# EAGLE design xnemo (EAGLE 6.2)
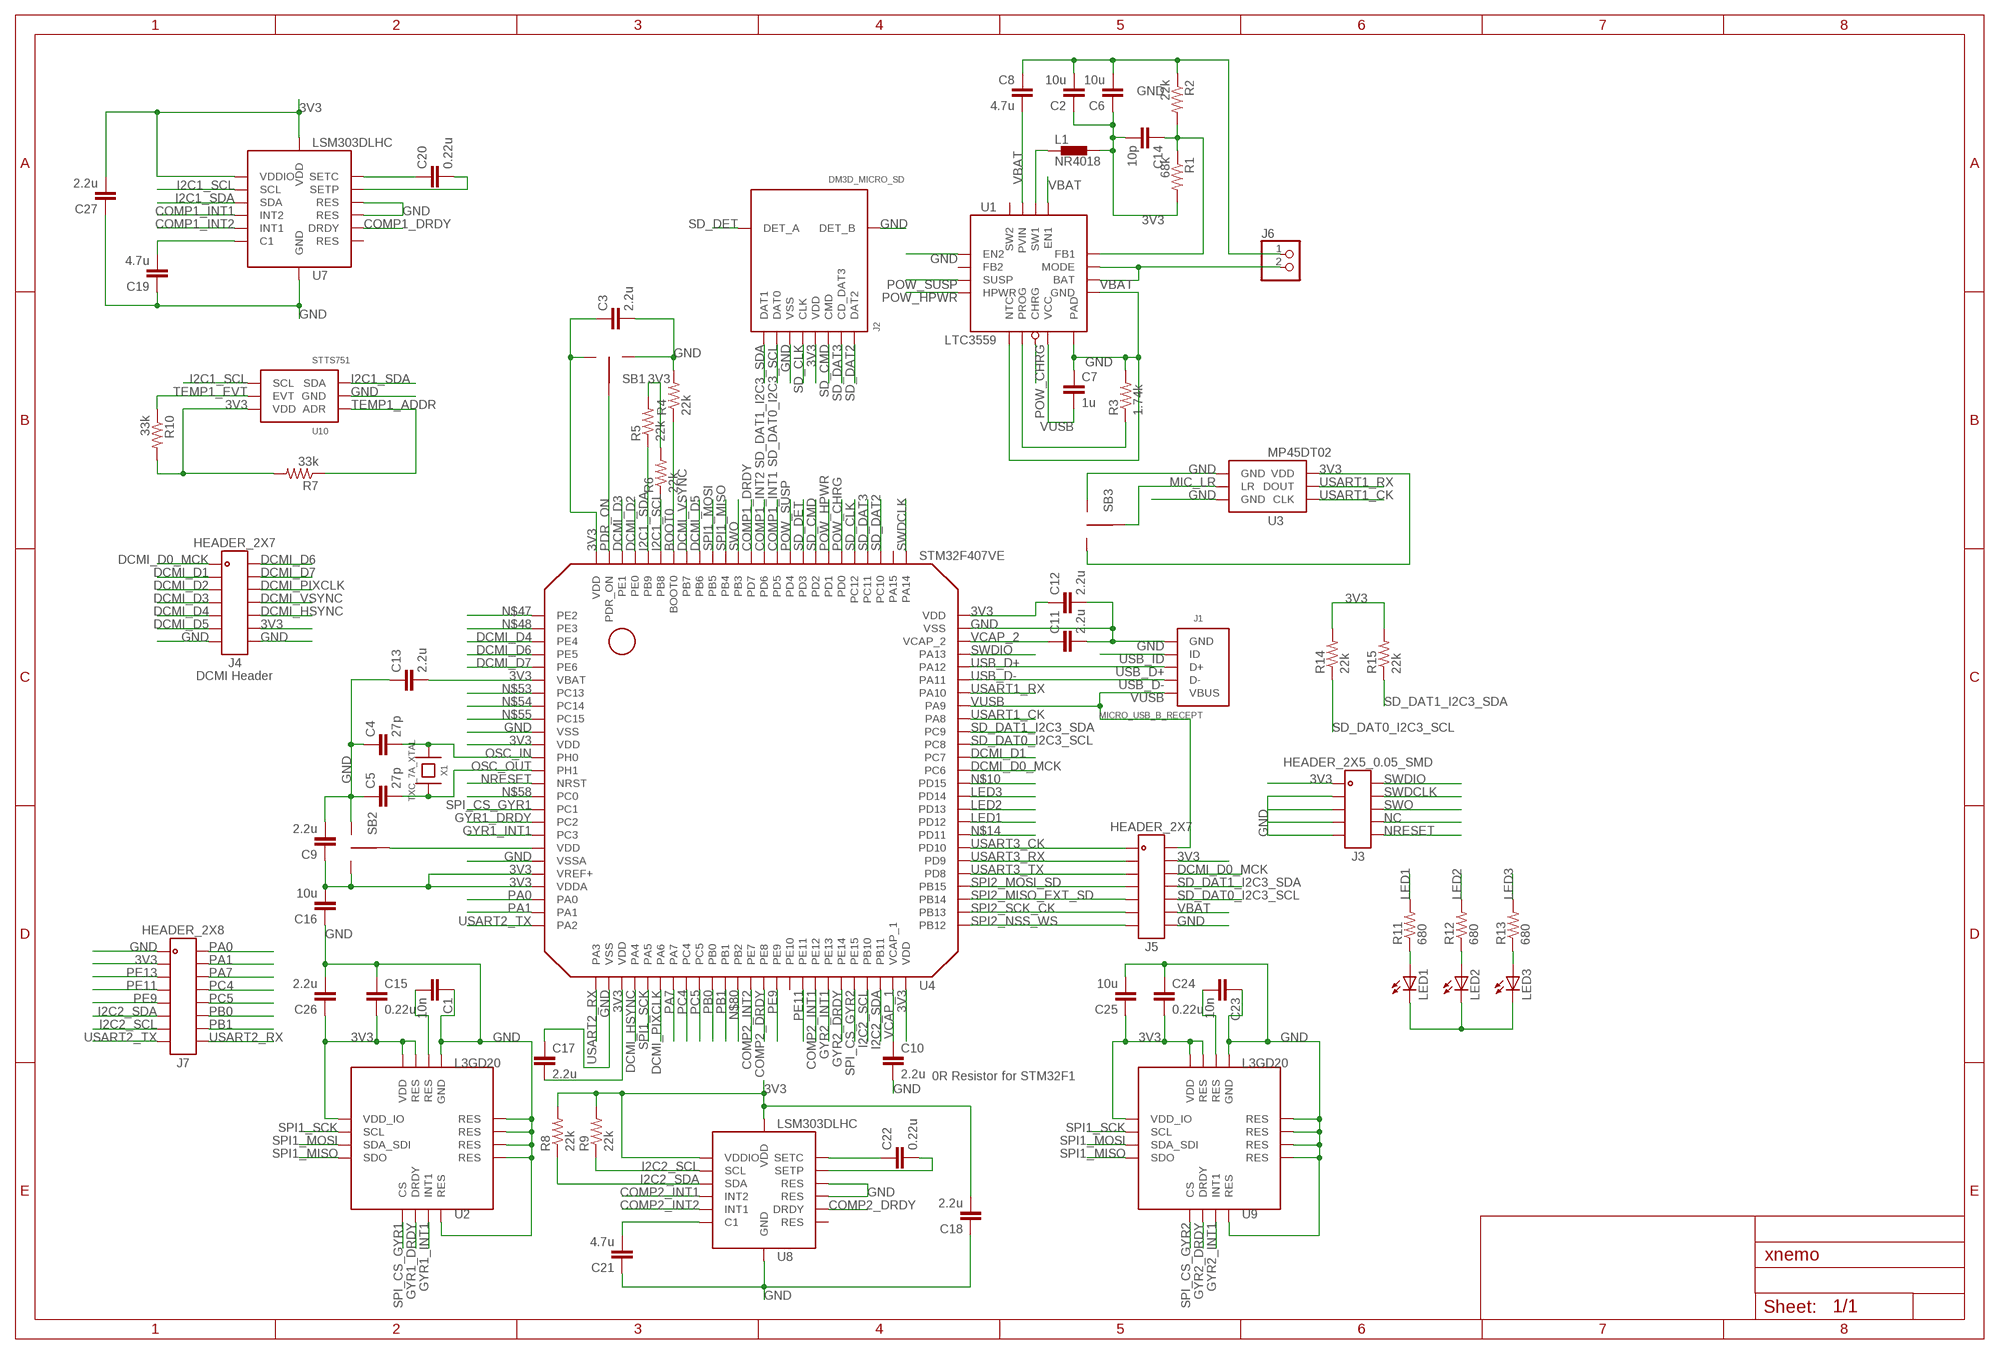
[diagram p0: schematic, sheet 1]

## Parts
C1  10n  C-EUC0402  [C0402]
C2  10u  C-EUC0805  [C0805]
C3  2.2u  C-EUC0603  [C0603]
C4  27p  C-EUC0402  [C0402]
C5  27p  C-EUC0402  [C0402]
C6  10u  C-EUC0805  [C0805]
C7  1u  C-EUC0603  [C0603]
C8  4.7u  C-EUC0805  [C0805]
C9  2.2u  C-EUC0603  [C0603]
C10  2.2u  C-EUC0603  [C0603]
C11  2.2u  C-EUC0603  [C0603]
C12  2.2u  C-EUC0603  [C0603]
C13  2.2u  C-EUC0603  [C0603]
C14  10p  C-EUC0402  [C0402]
C15  0.22u  C-EUC0402  [C0402]
C16  10u  C-EUC0805  [C0805]
C17  2.2u  C-EUC0603  [C0603]
C18  2.2u  C-EUC0603  [C0603]
C19  4.7u  C-EUC0805  [C0805]
C20  0.22u  C-EUC0402  [C0402]
C21  4.7u  C-EUC0805  [C0805]
C22  0.22u  C-EUC0402  [C0402]
C23  10n  C-EUC0402  [C0402]
C24  0.22u  C-EUC0402  [C0402]
C25  10u  C-EUC0805  [C0805]
C26  2.2u  C-EUC0603  [C0603]
C27  2.2u  C-EUC0603  [C0603]
J1  MICRO_USB_B_RECEPT  [FCI_MICRO_USB_B]
J2  DM3D_MICRO_SD  [HIROSE_DM3D]
J3  HEADER_2X5_0.05_SMD  [HEADER_2X5_0.05_SMD]
J4  HEADER_2X7  [HEADER_2X7_0.05X0.1_THRU]
J5  HEADER_2X7  [HEADER_2X7_0.05X0.1_THRU]
J6  PINHD-1X2  [1X02]
J7  HEADER_2X8  [HEADER_2X8_0.05X0.1_THRU]
L1  NR4018  [L_401X]
LED1  LEDSML0805  [SML0805]
LED2  LEDSML0805  [SML0805]
LED3  LEDSML0805  [SML0805]
R1  68k  R-US_R0402  [R0402]
R2  22k  R-US_R0402  [R0402]
R3  1.74k  R-US_R0402  [R0402]
R4  22k  R-US_R0402  [R0402]
R5  22k  R-US_R0402  [R0402]
R6  22k  R-US_R0402  [R0402]
R7  33k  R-US_R0402  [R0402]
R8  22k  R-US_R0402  [R0402]
R9  22k  R-US_R0402  [R0402]
R10  33k  R-US_R0402  [R0402]
R11  680  R-US_R0402  [R0402]
R12  680  R-US_R0402  [R0402]
R13  680  R-US_R0402  [R0402]
R14  22k  R-US_R0402  [R0402]
R15  22k  R-US_R0402  [R0402]
SB1  SOLDER_BRIDGE_2  [SOLDER_BRIDGE_2]
SB2  SOLDER_BRIDGE_2  [SOLDER_BRIDGE_2]
SB3  SOLDER_BRIDGE_2  [SOLDER_BRIDGE_2]
U1  LTC3559  [LT_QFN16_3X3]
U2  L3GD20  [ST_LGA16_4X4]
U3  MP45DT02  [ST_HLGA6]
U4  STM32F407VE  [ST_LQFP100]
U7  LSM303DLHC  [ST_LGA14_3X5]
U8  LSM303DLHC  [ST_LGA14_3X5]
U9  L3GD20  [ST_LGA16_4X4]
U10  STTS751  [ST_UDFN-6L_2X2]
X1  TXC_7A_XTAL  [TXC_7A_XTAL]

## Nets
3V3 [power]: C2.1 C3.1 C6.1 C9.1 C12.1 C13.2 C14.2 C15.2 C16.2 C17.2 C18.2 C24.2 C25.1 C26.1 C27.2 J2.P$5(VDD) J3.1 J4.12 J5.4 J7.3 L1.P$2 R1.2 R5.2 R6.2 R7.2 R8.2 R9.2 R10.2 R14.2 R15.2 SB1.P$1 SB2.P$1 SB3.P$1 U2.P$1(VDD_IO) U2.P$15(RES) U2.P$16(VDD) U3.6(VDD) U4.P$6(VBAT) U4.P$11(VDD) U4.P$21(VREF+) U4.P$22(VDDA) U4.P$28(VDD) U4.P$50(VDD) U4.P$75(VDD) U4.P$100(VDD) U7.P$1(VDDIO) U7.P$14(VDD) U8.P$1(VDDIO) U8.P$14(VDD) U9.P$1(VDD_IO) U9.P$15(RES) U9.P$16(VDD) U10.3(VDD)
BOOT0: R4.1 U4.P$94(BOOT0)
BUCK_FB1: C14.1 R1.1 R2.2 U1.P$4(FB1)
BUCK_SW1: L1.P$1 U1.P$6(SW1)
COMP1_C1: C19.2 U7.P$6(C1)
COMP1_DRDY: U4.P$88(PD7) U7.P$9(DRDY)
COMP1_INT1: U4.P$86(PD5) U7.P$4(INT2)
COMP1_INT2: U4.P$87(PD6) U7.P$5(INT1)
COMP2_C1: C21.2 U8.P$6(C1)
COMP2_DRDY: U4.P$39(PE8) U8.P$9(DRDY)
COMP2_INT1: U4.P$43(PE12) U8.P$4(INT2)
COMP2_INT2: U4.P$38(PE7) U8.P$5(INT1)
DCMI_D0_MCK: J4.1 J5.6 U4.P$63(PC6)
DCMI_D1: J4.3 U4.P$64(PC7)
DCMI_D2: J4.5 U4.P$97(PE0)
DCMI_D3: J4.7 U4.P$98(PE1)
DCMI_D4: J4.9 U4.P$3(PE4)
DCMI_D5: J4.11 U4.P$92(PB6)
DCMI_D6: J4.2 U4.P$4(PE5)
DCMI_D7: J4.4 U4.P$5(PE6)
DCMI_HSYNC: J4.10 U4.P$29(PA4)
DCMI_PIXCLK: J4.6 U4.P$31(PA6)
DCMI_VSYNC: J4.8 U4.P$93(PB7)
GND: C1.1 C2.2 C3.2 C4.1 C5.1 C6.2 C7.1 C8.1 C9.2 C10.2 C11.2 C12.2 C13.1 C15.1 C16.1 C17.1 C18.1 C19.1 C21.1 C23.1 C24.1 C25.2 C26.2 C27.1 J1.P$5(GND) J2.P$3(VSS) J2.P$9(DET_B) J3.3 J3.5 J3.7 J3.9 J4.13 J4.14 J5.14 J6.1 J7.1 LED1.C LED2.C LED3.C R2.1 R3.2 R4.2 SB1.P$3 SB2.P$3 SB3.P$3 U1.P$1(GND) U1.P$9(EN2) U1.P$13(NTC) U1.P$17(PAD) U2.P$8(RES) U2.P$9(RES) U2.P$10(RES) U2.P$11(RES) U2.P$12(RES) U2.P$13(GND) U3.1(GND) U3.3(GND) U4.P$10(VSS) U4.P$20(VSSA) U4.P$27(VSS) U4.P$74(VSS) U7.P$7(GND) U7.P$10(RES) U7.P$11(RES) U8.P$7(GND) U8.P$10(RES) U8.P$11(RES) U9.P$8(RES) U9.P$9(RES) U9.P$10(RES) U9.P$11(RES) U9.P$12(RES) U9.P$13(GND) U10.5(GND)
GYR1_DRDY: U2.P$6(DRDY) U4.P$17(PC2)
GYR1_INT1: U2.P$7(INT1) U4.P$18(PC3)
GYR2_DRDY: U4.P$45(PE14) U9.P$6(DRDY)
GYR2_INT1: U4.P$44(PE13) U9.P$7(INT1)
GYR_RES1: C1.2 U2.P$14(RES)
GYR_RES2: C23.2 U9.P$14(RES)
I2C1_SCL: R6.1 U4.P$95(PB8) U7.P$2(SCL) U10.1(SCL)
I2C1_SDA: R5.1 U4.P$96(PB9) U7.P$3(SDA) U10.6(SDA)
I2C2_SCL: J7.13 R9.1 U4.P$47(PB10) U8.P$2(SCL)
I2C2_SDA: J7.11 R8.1 U4.P$48(PB11) U8.P$3(SDA)
LED1: R11.2 U4.P$59(PD12)
LED2: R12.2 U4.P$60(PD13)
LED3: R13.2 U4.P$61(PD14)
MIC_LR: SB3.P$2 U3.2(LR)
N$6: C22.2 U8.P$12(SETP)
N$7: C20.2 U7.P$12(SETP)
N$9: LED1.A R11.1
N$10: U4.P$62(PD15)
N$14: U4.P$58(PD11)
N$16: LED2.A R12.1
N$17: LED3.A R13.1
N$23: C22.1 U8.P$13(SETC)
N$27: C20.1 U7.P$13(SETC)
N$47: U4.P$1(PE2)
N$48: U4.P$2(PE3)
N$53: U4.P$7(PC13)
N$54: U4.P$8(PC14)
N$55: U4.P$9(PC15)
N$58: U4.P$15(PC0)
N$62: SB2.P$2 U4.P$19(VDD)
N$80: U4.P$37(PB2)
NC: J3.8
NRESET: J3.10 U4.P$14(NRST)
OSC_IN: C4.2 U4.P$12(PH0) X1.P$2
OSC_OUT: C5.2 U4.P$13(PH1) X1.P$1
PA0: J7.2 U4.P$23(PA0)
PA1: J7.4 U4.P$24(PA1)
PA7: J7.6 U4.P$32(PA7)
PB0: J7.12 U4.P$35(PB0)
PB1: J7.14 U4.P$36(PB1)
PC4: J7.8 U4.P$33(PC4)
PC5: J7.10 U4.P$34(PC5)
PDR_ON: SB1.P$2 U4.P$99(PDR_ON)
PE9: J7.9 U4.P$40(PE9)
PE11: J7.7 U4.P$42(PE11)
PE13: J7.5
POW_CHRG: U1.P$15(CHRG) U4.P$81(PD0)
POW_HPWR: U1.P$12(HPWR) U4.P$82(PD1)
POW_PROG: R3.1 U1.P$14(PROG)
POW_SUSP: U1.P$11(SUSP) U4.P$85(PD4)
SD_CLK: J2.P$4(CLK) U4.P$80(PC12)
SD_CMD: J2.P$6(CMD) U4.P$83(PD2)
SD_DAT0_I2C3_SCL: J2.P$2(DAT0) J5.10 R14.1 U4.P$65(PC8)
SD_DAT1_I2C3_SDA: J2.P$1(DAT1) J5.8 R15.1 U4.P$66(PC9)
SD_DAT2: J2.P$8(DAT2) U4.P$78(PC10)
SD_DAT3: J2.P$7(CD_DAT3) U4.P$79(PC11)
SD_DET: J2.P$10(DET_A) U4.P$84(PD3)
SPI1_MISO: U2.P$4(SDO) U4.P$90(PB4) U9.P$4(SDO)
SPI1_MOSI: U2.P$3(SDA_SDI) U4.P$91(PB5) U9.P$3(SDA_SDI)
SPI1_SCK: U2.P$2(SCL) U4.P$30(PA5) U9.P$2(SCL)
SPI2_MISO_EXT_SD: J5.9 U4.P$53(PB14)
SPI2_MOSI_SD: J5.7 U4.P$54(PB15)
SPI2_NSS_WS: J5.13 U4.P$51(PB12)
SPI2_SCK_CK: J5.11 U4.P$52(PB13)
SPI_CS_GYR1: U2.P$5(CS) U4.P$16(PC1)
SPI_CS_GYR2: U4.P$46(PE15) U9.P$5(CS)
SWDCLK: J3.4 U4.P$76(PA14)
SWDIO: J3.2 U4.P$72(PA13)
SWO: J3.6 U4.P$89(PB3)
TEMP1_ADDR: R7.1 U10.4(ADR)
TEMP1_EVT: R10.1 U10.2(EVT)
USART1_CK: U3.4(CLK) U4.P$67(PA8)
USART1_RX: U3.5(DOUT) U4.P$69(PA10)
USART2_RX: J7.16 U4.P$26(PA3)
USART2_TX: J7.15 U4.P$25(PA2)
USART3_CK: J5.1 U4.P$57(PD10)
USART3_RX: J5.3 U4.P$56(PD9)
USART3_TX: J5.5 U4.P$55(PD8)
USB_D+: J1.P$3(D+) U4.P$71(PA12)
USB_D-: J1.P$2(D-) U4.P$70(PA11)
USB_ID: J1.P$4(ID)
VBAT: C8.2 J5.12 J6.2 U1.P$2(BAT) U1.P$3(MODE) U1.P$5(EN1) U1.P$7(PVIN)
VCAP_1: C10.1 U4.P$49(VCAP_1)
VCAP_2: C11.1 U4.P$73(VCAP_2)
VUSB: C7.2 J1.P$1(VBUS) J5.2 U1.P$16(VCC) U4.P$68(PA9)
Unconnected: U1.P$8(SW2) U1.P$10(FB2) U4.P$41(PE10) U4.P$77(PA15) U7.P$8(RES) U8.P$8(RES)

## Notes on the sheet
- DCMI Header
- 0R Resistor for STM32F1

## Library data of the parts
C1-C27 = resistor:C-EU: CAPACITOR, European symbol
J1 = xnemo:MICRO_USB_B_RECEPT
J2 = xnemo:DM3D_MICRO_SD
J3 = xnemo:HEADER_2X5
J4 J5 = xnemo:HEADER_2X7
J6 = pinhead:PINHD-1X2: PIN HEADER
J7 = xnemo:HEADER_2X8
L1 = xnemo:NR4018: Taiyo Yuden NR401x SMT power inductor
LED1-LED3 = led:LED: LED OSRAM: - CHIPLED LG R971, LG N971, LY N971, LG Q971, LY Q971, LO R971, LY R971 LH N974, LH R974 LS Q976, LO Q976, LY Q976 LO Q996 - Hyper CHIPLED LW Q18S LB Q993, LB Q99A, LB R99A - SideLED LS A670, LO A670, LY A670, LG A670, LP A670 LB A673, LV A673, LT A673, LW A673 LH A674 LY A675 LS A676, LA A676, LO A676, LY A676, LW A676 LS A679, LY A679, LG A679 - Hyper Micro SIDELED® LS Y876, LA Y876, LO Y876, LY Y876 LT Y87S - SmartLED LW L88C, LW L88S LB L89C, LB L89S, LG L890 LS L89K, LO L89K, LY L89K LS L896, LA L896, LO L896, LY L896 - TOPLED LS T670, LO T670, LY T670, LG T670, LP T670 LSG T670, LSP T670, LSY T670, LOP T670, LYG T670 LG T671, LOG T671, LSG T671 LB T673, LV T673, LT T673, LW T673 LH T674 LS T676, LA T676, LO T676, LY T676, LB T676, LH T676, LSB T676, LW T676 LB T67C, LV T67C, LT T67C, LS T67K, LO T67K, LY T67K, LW E67C LS E67B, LA E67B, LO E67B, LY E67B, LB E67C, LV E67C, LT E67C LW T67C LS T679, LY T679, LG T679 LS T770, LO T770, LY T770, LG T770, LP T770 LB T773, LV T773, LT T773, LW T773 LH T774 LS E675, LA E675, LY E675, LS T675 LS T776, LA T776, LO T776, LY T776, LB T776 LHGB T686 LT T68C, LB T68C - Hyper Mini TOPLED® LB M676 - Mini TOPLED Santana® LG M470 LS M47K, LO M47K, LY M47K Source: http://www.osram.convergy.de LUXEON: - LUMILED® LXK2-PW12-R00, LXK2-PW12-S00, LXK2-PW14-U00, LXK2-PW14-V00 LXK2-PM12-R00, LXK2-PM12-S00, LXK2-PM14-U00 LXK2-PE12-Q00, LXK2-PE12-R00, LXK2-PE12-S00, LXK2-PE14-T00, LXK2-PE14-U00 LXK2-PB12-K00, LXK2-PB12-L00, LXK2-PB12-M00, LXK2-PB14-N00, LXK2-PB14-P00, LXK2-PB14-Q00 LXK2-PR12-L00, LXK2-PR12-M00, LXK2-PR14-Q00, LXK2-PR14-R00 LXK2-PD12-Q00, LXK2-PD12-R00, LXK2-PD12-S00 LXK2-PH12-R00, LXK2-PH12-S00 LXK2-PL12-P00, LXK2-PL12-Q00, LXK2-PL12-R00 Source: www.luxeon.com KINGBRIGHT: KA-3528ASYC Source: www.kingbright.com
R1-R15 = resistor:R-US_: RESISTOR, American symbol
SB1-SB3 = xnemo:SOLDER_BRIDGE_2
U1 = xnemo:LTC3559: LTC3559 USB LiPo charger with dual buck switching regulators
U2 U9 = xnemo:L3GD20
U3 = xnemo:MP45DT02: Digital MEMS microphone
U4 = xnemo:STM32F407VE: STM32F407VE 32-bit ARM Cortex M4 Microcontroller
U7 U8 = xnemo:LSM303DLHC: ST LSM303DLHC I2C MEMS Magnetometer and Accelerometer
U10 = xnemo:STTS751: ST STTS751 I2C Digital Temperature Sensor
X1 = xnemo:TXC_7A_XTAL

## Board
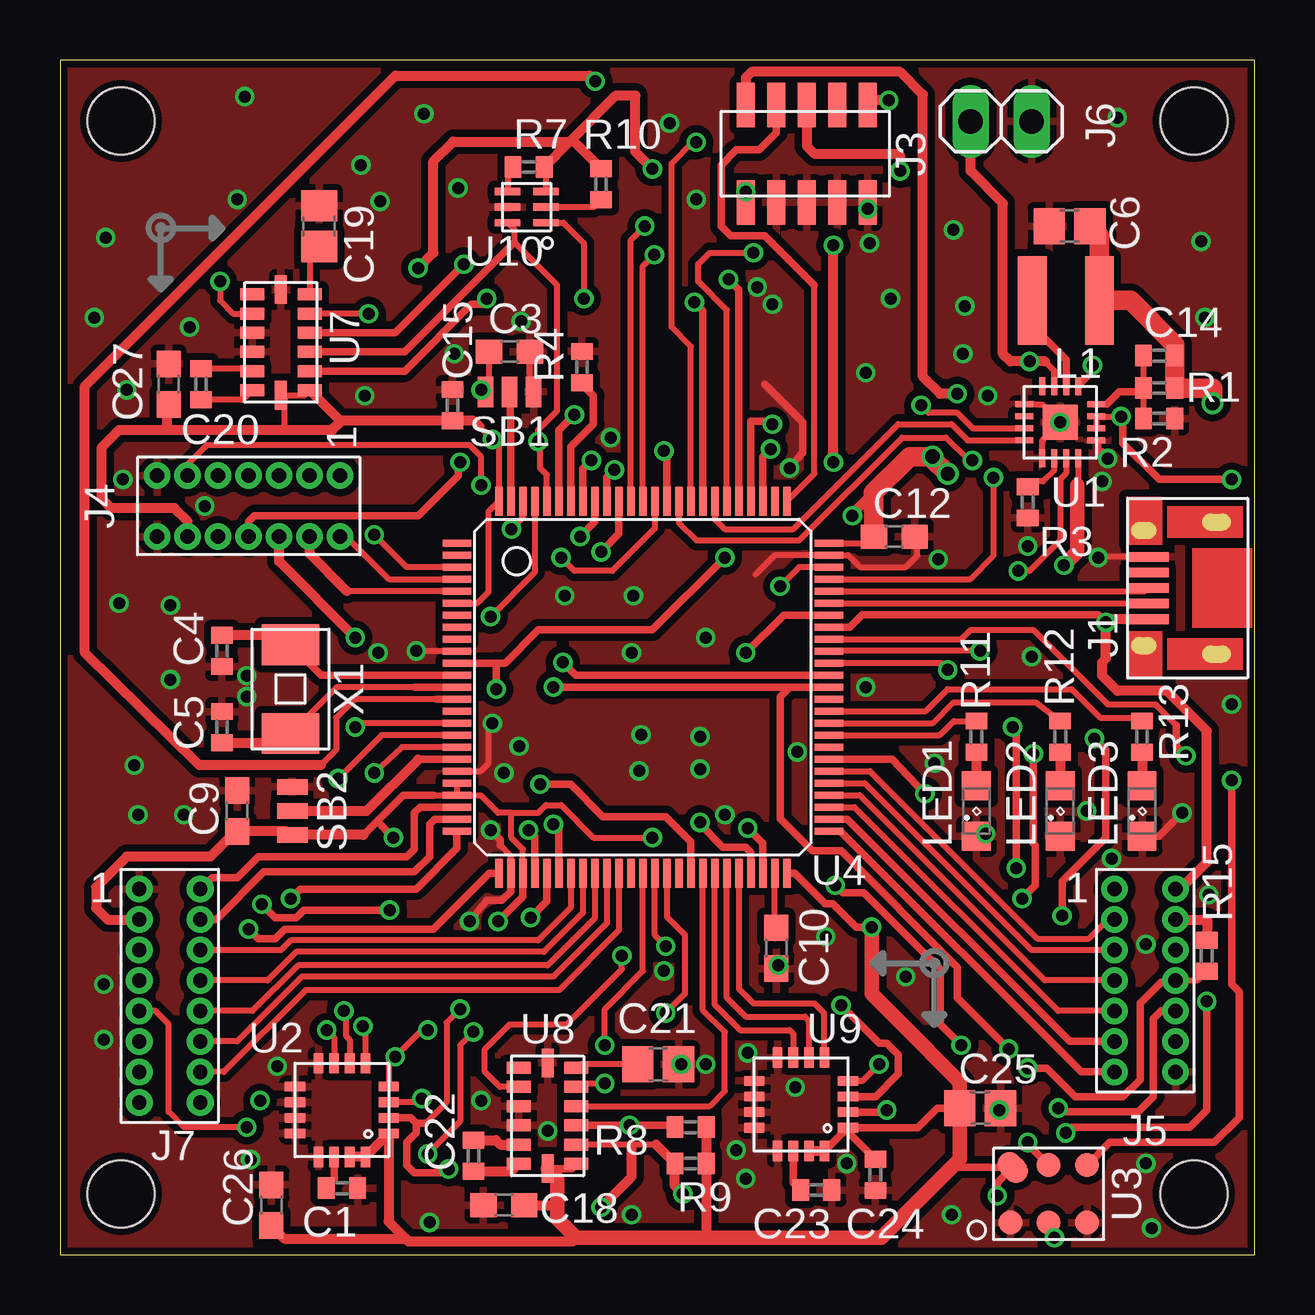
[diagram p1: board, top side]
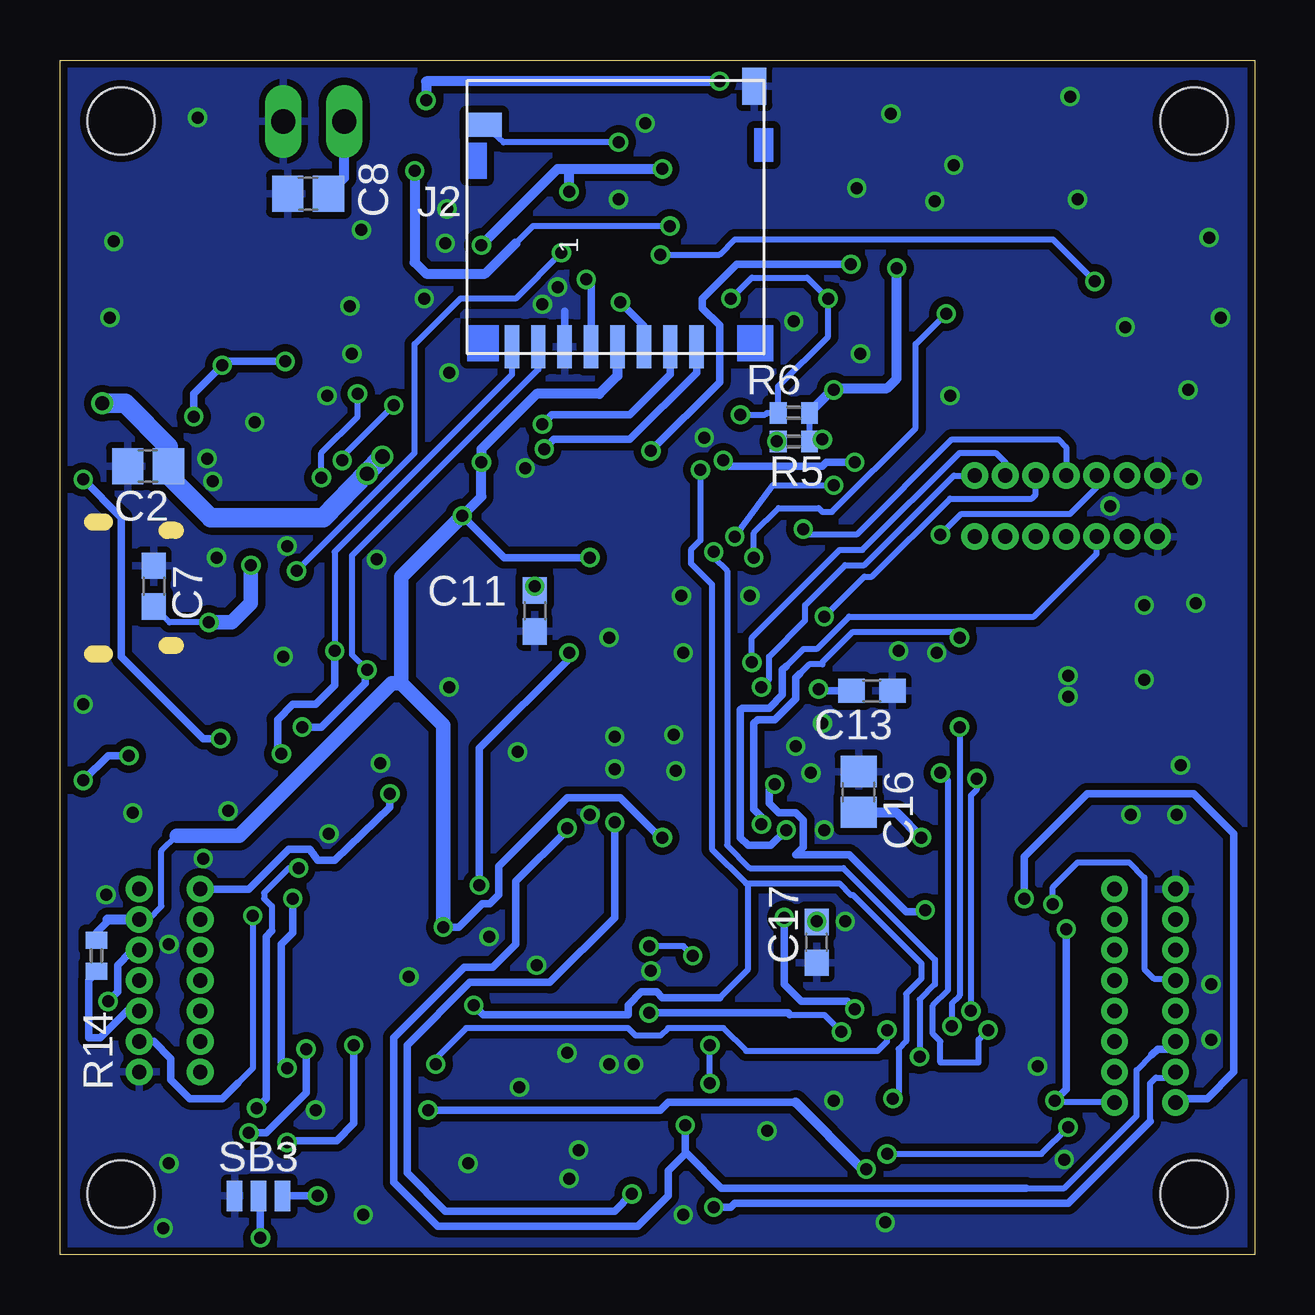
[diagram p2: board, bottom side, seen from below]

Size 49.78 x 49.78 mm. Coordinates in mm from the lower left corner, seen from the top.
Outline: 0,0 49.78,0 49.78,49.78 0,49.78 0,0
Copper layers (1*16): Top 0.035mm / dielectric 1.5mm / Bottom 0.035mm
Design rules: minimum track width 6mil, minimum drill 12mil, track to track 6mil, track to pad 6mil, pad to pad 6mil, via to via 6mil, smd to smd 0mil, copper to edge 10mil, drill to drill 10mil, minimum pad ring 10mil, minimum via ring 6mil, stop-mask expansion 2mil, vias tented up to drill 100mil, thermal gap 10mil
Holes 2.8 mm at 47.24,2.54 47.24,47.24 2.54,47.24 2.54,2.54

### Footprints (pad centres in the part's own frame; a part is rotated, then mirrored left to right if it is on the bottom)
C0402 = smd 0.7 x 0.9: 1 -0.65,0; 2 0.65,0
C0805 = smd 1.3 x 1.5: 1 -0.85,0; 2 0.85,0
C0603 = smd 1.1 x 1: 1 -0.85,0; 2 0.85,0
FCI_MICRO_USB_B = smd 0.4 x 1.75: P$1 -1.3,2.85; P$2 -0.65,2.85; P$3 0,2.85; P$4 0.65,2.85; P$5 1.3,2.85
HIROSE_DM3D = smd 0.6 x 1.8: P$1 -3.81,-5.98; P$2 -2.71,-5.98; P$3 -1.61,-5.98; P$4 -0.51,-5.98; P$5 0.59,-5.98; P$6 1.69,-5.98; P$7 2.79,-5.98; P$8 3.89,-5.98 | smd 1 x 1.55: P$9 6.29,4.87 | smd 1.45 x 1: P$10 -4.96,3.27
HEADER_2X5_0.05_SMD = smd 1.854 x 0.737: 1 -2.032,2.54; 2 2.032,2.54; 3 -2.032,1.27; 4 2.032,1.27; 5 -2.032,0; 6 2.032,0; 7 -2.032,-1.27; 8 2.032,-1.27; 9 -2.032,-2.54; 10 2.032,-2.54
HEADER_2X7_0.05X0.1_THRU = drill 0.6 pad 1.016: 1 -1.27,5.08; 2 1.27,5.08; 3 -1.27,3.81; 4 1.27,3.81; 5 -1.27,2.54; 6 1.27,2.54; 7 -1.27,1.27; 8 1.27,1.27; 9 -1.27,0; 10 1.27,0; 11 -1.27,-1.27; 12 1.27,-1.27; 13 -1.27,-2.54; 14 1.27,-2.54
1X02 = drill 1.016 long: 1 -1.27,0; 2 1.27,0
HEADER_2X8_0.05X0.1_THRU = drill 0.6 pad 1.016: 1 -1.27,5.08; 2 1.27,5.08; 3 -1.27,3.81; 4 1.27,3.81; 5 -1.27,2.54; 6 1.27,2.54; 7 -1.27,1.27; 8 1.27,1.27; 9 -1.27,0; 10 1.27,0; 11 -1.27,-1.27; 12 1.27,-1.27; 13 -1.27,-2.54; 14 1.27,-2.54; 15 -1.27,-3.81; 16 1.27,-3.81
L_401X = smd 1.2 x 3.7: P$1 -1.4,0; P$2 1.4,0
SML0805 = smd 1.2 x 1.2: A 1.05,0; C -1.05,0
R0402 = smd 0.7 x 0.9: 1 -0.65,0; 2 0.65,0
SOLDER_BRIDGE_2 = smd 0.635 x 1.27: P$1 -1,0; P$2 0,0; P$3 1,0
LT_QFN16_3X3 = smd 0.75 x 0.25: P$1 -1.5,0.75; P$2 -1.5,0.25; P$3 -1.5,-0.25; P$4 -1.5,-0.75; P$9 1.5,-0.75; P$10 1.5,-0.25; P$11 1.5,0.25; P$12 1.5,0.75 | smd 0.25 x 0.75: P$5 -0.75,-1.5; P$6 -0.25,-1.5; P$7 0.25,-1.5; P$8 0.75,-1.5; P$13 0.75,1.5; P$14 0.25,1.5; P$15 -0.25,1.5; P$16 -0.75,1.5 | smd 1.45 x 1.45: P$17 0,0
ST_LGA16_4X4 = smd 0.85 x 0.4: P$1 -1.95,0.975; P$2 -1.95,0.325; P$3 -1.95,-0.325; P$4 -1.95,-0.975; P$9 1.95,-0.975; P$10 1.95,-0.325; P$11 1.95,0.325; P$12 1.95,0.975 | smd 0.4 x 0.85: P$5 -0.975,-1.95; P$6 -0.325,-1.95; P$7 0.325,-1.95; P$8 0.975,-1.95; P$13 0.975,1.95; P$14 0.325,1.95; P$15 -0.325,1.95; P$16 -0.975,1.95
ST_HLGA6 = smd 1 x 1: 1 -1.2,1.6; 2 -1.2,0; 3 -1.2,-1.6; 4 1.2,-1.6; 5 1.2,0 | smd 1 x 1.4 rotated 135: 6 1.1,1.5
ST_LQFP100 = smd 1.2 x 0.3: P$1 -7.75,6; P$2 -7.75,5.5; P$3 -7.75,5; P$4 -7.75,4.5; P$5 -7.75,4; P$6 -7.75,3.5; P$7 -7.75,3; P$8 -7.75,2.5; P$9 -7.75,2; P$10 -7.75,1.5; P$11 -7.75,1; P$12 -7.75,0.5; P$13 -7.75,0; P$14 -7.75,-0.5; P$15 -7.75,-1; P$16 -7.75,-1.5; P$17 -7.75,-2; P$18 -7.75,-2.5; P$19 -7.75,-3; P$20 -7.75,-3.5; P$21 -7.75,-4; P$22 -7.75,-4.5; P$23 -7.75,-5; P$24 -7.75,-5.5; P$25 -7.75,-6; P$51 7.75,-6; P$52 7.75,-5.5; P$53 7.75,-5; P$54 7.75,-4.5; P$55 7.75,-4; P$56 7.75,-3.5; P$57 7.75,-3; P$58 7.75,-2.5; P$59 7.75,-2; P$60 7.75,-1.5; P$61 7.75,-1; P$62 7.75,-0.5; P$63 7.75,0; P$64 7.75,0.5; P$65 7.75,1; P$66 7.75,1.5; P$67 7.75,2; P$68 7.75,2.5; P$69 7.75,3; P$70 7.75,3.5; P$71 7.75,4; P$72 7.75,4.5; P$73 7.75,5; P$74 7.75,5.5; P$75 7.75,6 | smd 0.3 x 1.2: P$26 -6,-7.75; P$27 -5.5,-7.75; P$28 -5,-7.75; P$29 -4.5,-7.75; P$30 -4,-7.75; P$31 -3.5,-7.75; P$32 -3,-7.75; P$33 -2.5,-7.75; P$34 -2,-7.75; P$35 -1.5,-7.75; P$36 -1,-7.75; P$37 -0.5,-7.75; P$38 0,-7.75; P$39 0.5,-7.75; P$40 1,-7.75; P$41 1.5,-7.75; P$42 2,-7.75; P$43 2.5,-7.75; P$44 3,-7.75; P$45 3.5,-7.75; P$46 4,-7.75; P$47 4.5,-7.75; P$48 5,-7.75; P$49 5.5,-7.75; P$50 6,-7.75; P$76 6,7.75; P$77 5.5,7.75; P$78 5,7.75; P$79 4.5,7.75; P$80 4,7.75; P$81 3.5,7.75; P$82 3,7.75; P$83 2.5,7.75; P$84 2,7.75; P$85 1.5,7.75; P$86 1,7.75; P$87 0.5,7.75; P$88 0,7.75; P$89 -0.5,7.75; P$90 -1,7.75; P$91 -1.5,7.75; P$92 -2,7.75; P$93 -2.5,7.75; P$94 -3,7.75; P$95 -3.5,7.75; P$96 -4,7.75; P$97 -4.5,7.75; P$98 -5,7.75; P$99 -5.5,7.75; P$100 -6,7.75
ST_LGA14_3X5 = smd 1 x 0.5: P$1 -1.2,2; P$2 -1.2,1.2; P$3 -1.2,0.4; P$4 -1.2,-0.4; P$5 -1.2,-1.2; P$6 -1.2,-2; P$8 1.2,-2; P$9 1.2,-1.2; P$10 1.2,-0.4; P$11 1.2,0.4; P$12 1.2,1.2; P$13 1.2,2 | smd 0.5 x 1.2: P$7 0,-2.2; P$14 0,2.2
ST_UDFN-6L_2X2 = smd 1.05 x 0.3: 1 -0.8,0.65; 2 -0.8,0; 3 -0.8,-0.65; 4 0.8,-0.65; 5 0.8,0; 6 0.8,0.65
TXC_7A_XTAL = smd 1.7 x 2.4: P$1 -1.85,0; P$2 1.85,0

### Placement (x,y rotation side)
C1  11.75,2.78 180 top
C2  46.12,32.86 180 bottom
C3  18.73,37.62 0 top
C4  6.75,25.16 90 top
C5  6.75,21.99 270 top
C6  42.07,42.86 180 top
C7  45.88,27.86 270 bottom
C8  39.45,44.21 0 bottom
C9  7.38,18.49 90 top
C10  29.84,12.78 270 top
C11  30,26.83 270 bottom
C12  34.77,29.92 0 top
C13  15.95,23.5 180 bottom
C14  45.8,37.47 0 top
C15  16.35,35.4 270 top
C16  16.51,19.29 270 bottom
C17  18.26,13.02 90 bottom
C18  18.49,2.06 0 top
C19  10.79,42.86 270 top
C20  5.87,36.27 90 top
C21  24.92,7.94 180 top
C22  17.22,4.13 90 top
C23  31.51,2.7 180 top
C24  33.97,3.33 90 top
C25  38.34,6.11 0 top
C26  8.81,2.06 90 top
C27  4.52,36.27 270 top
J1  48.18,27.78 90 top
J2  27.15,43.81 0 bottom
J3  31.11,45.88 90 top
J4  6.59,31.19 270 top
J5  45.21,10.16 0 top
J6  39.21,47.23 180 top
J7  4.57,10.16 0 top
L1  41.91,39.77 0 top
LED1  38.18,18.49 90 top
LED2  41.67,18.49 90 top
LED3  45.09,18.49 90 top
R1  45.8,36.12 0 top
R2  45.8,34.85 180 top
R3  40.32,31.35 270 top
R4  21.75,36.99 90 top
R5  19.21,33.89 0 bottom
R6  19.21,35.08 0 bottom
R7  19.53,45.32 0 top
R8  26.27,5.32 0 top
R9  26.27,3.81 0 top
R10  22.54,44.61 90 top
R11  38.18,21.59 90 top
R12  41.67,21.59 90 top
R13  45.09,21.59 90 top
R14  48.26,12.46 90 bottom
R15  47.78,12.46 90 top
SB1  18.73,35.96 0 top
SB2  9.68,18.49 90 top
SB3  41.51,2.46 180 bottom
U1  41.67,34.69 180 top
U2  11.75,6.03 180 top
U3  41.2,2.54 90 top
U4  24.29,23.65 0 top
U7  9.21,38.02 180 top
U8  20.32,5.79 180 top
U9  30.88,6.27 180 top
U10  19.45,43.66 180 top
X1  9.6,23.57 90 top

### Tracks (layer width: path | path; a pad name or v marks a point on that pad's centre or on a via)
3V3  (via drill 0.5, 0.6)
  Top 0.254: C3.1 17.88,36.11 SB1.P$1 17.62,35.85 | U4.P$6 17.39,27.15 17.86,27.62 17.86,30.97 U4.P$100 18.29,33.7 v18.02,33.97 17.48,34.51 | U4.P$75 33.65,29.65 C12.1 | 15.58,19.15 U4.P$22 | 18.81,18.41 18.81,17.38 19.29,16.91 U4.P$28 | U7.P$1 10.21,35.82 U7.P$14 9.37,35.66 9.37,34.53 9.21,34.37 | R7.2 20.25,45.25 U10.3 | 21.24,46.39 21.2,46.35 21.45,46.35 | 18.81,18.41 19.92,18.41 20.24,18.73 20.88,18.73 22.23,17.38 v24.69,17.38 | 18.81,18.41 18.26,18.41 17.54,19.13 16.56,19.13 U4.P$22 | U4.P$21 U4.P$22 | J3.1 v28.57,44.29
  Top 0.305: 15.58,19.15 14.31,19.15 13.22,18.06 | 13.22,18.06 12.65,17.49 | SB2.P$1 9.45,17.64 | U4.P$11 18.18,24.65 | 18.18,24.65 18.54,24.65 19.92,26.04 24.69,26.04 v27.7,29.05 | v13.89,17.38 13.22,18.06 | U4.P$28 19.29,14.92 v18.26,13.89 | U8.P$14 21.32,3.59 U8.P$1 | U9.P$1 35.74,5.3 36.56,6.11 C25.1 | 26.92,0.94 27.15,0.71 | U9.P$16 U9.P$1 | 21.35,0.56 21.51,0.71 | C9.1 7.33,17.64 | v18.18,23.57 18.18,24.65 | 35.12,9.72 34.97,9.72 | C24.2 32.83,5.13 U9.P$1 | 37.03,3.53 37.14,3.64 U3.6 39.05,3 v39.05,2.46 | U4.P$50 30.61,15.9 31.88,14.63 32.2,14.63 33.18,13.65 v33.81,13.65
  Top 0.406: R7.2 21.2,46.35 | 33.89,31.75 33.02,30.88 v33.02,30.8 | v32.23,33.02 v32.23,42.07 | v24.69,45.24 23.97,45.96 23.97,48.31 23.16,48.31 21.24,46.39 16.38,46.39 15.56,45.56 15.56,41.75 v14.92,41.12 | v17.54,36.04 17.62,35.96 SB1.P$1 | 12.65,17.49 SB2.P$1 | 9.45,17.64 C9.1 | R10.2 21.45,46.35 | J5.4 47.8,13.97 R15.2 | J7.3 1.98,13.97 1.51,14.45 1.51,15.32 2.78,16.59 6.27,16.59 7.33,17.64 | 26.92,0.94 R9.2 R8.2 | U2.P$15 U2.P$16 U2.P$1 13.7,1.38 14.41,0.68 | 14.41,0.68 14.53,0.56 21.35,0.56 | 17.48,34.51 17.24,34.75 C15.2 11.68,34.75 | 11.68,34.75 U7.P$1 | J4.12 5.32,30.56 4.76,31.11 2.14,31.11 1.75,31.51 1.75,33.66 2.46,34.37 4.45,34.37 | 4.45,34.37 11.35,34.37 11.67,34.69 11.67,34.74 11.68,34.75 | U9.P$16 U9.P$15 | C18.2 20.72,2.06 | C26.1 9.35,0.68 14.41,0.68 | C27.2 4.45,35.34 4.45,34.37
  Top 0.61: U8.P$14 20.72,3.2 20.72,2.06 20.72,1.51 21.51,0.71 27.15,0.71 34.21,0.71 37.03,3.53 37.49,3.99 C25.1 37.49,7.2 34.97,9.72 33.81,10.87 v33.81,13.65
  Top 0.813: C6.1 43.31,42.47 L1.P$2 44.61,39.77 46.45,37.93 C14.2 R1.2 48.02,36.12 v48.02,35.48 | 33.92,31.77 35.4,33.26 v36.35,33.26 36.35,33.18 v36.99,32.54 | 33.92,31.77 C12.1 | 33.92,31.77 33.89,31.75 33.89,31.04
  Bottom 0.254: J5.4 46.12,13.97 45.56,14.53 45.56,16.83 44.93,17.46 | R6.2 R5.2
  Bottom 0.305: v27.7,29.05 31.27,29.05 v33.02,30.8 | v18.26,13.89 C17.2 | C13.2 18.1,23.5 v18.18,23.57 | v24.69,17.38 24.77,17.38 26.43,19.05 28.65,19.05 31.51,16.19 31.51,15 31.88,14.63 32.2,14.63 33.18,13.65 v33.81,13.65 | SB3.P$1 v39.05,2.46 | R14.2 48.26,13.43 47.8,13.89 | 47.8,13.89 | 47.8,13.97 47.8,13.89
  Bottom 0.406: v33.02,30.8 32.23,31.59 v32.23,33.02 32.23,33.58 29.92,35.88 27.3,35.88 26.56,36.63 J2.P$5 | v32.23,42.07 29.05,45.24 28.73,45.24 | 28.73,45.24 v24.69,45.24 | v14.92,41.12 14.92,36.51 15.32,36.12 17.46,36.12 v17.54,36.04 17.61,36.04 R6.2 | J5.4 47.8,13.97 | v18.02,33.97 18.1,33.89 R5.2 | v28.57,44.29 28.57,45.09 28.73,45.24 | C16.2 14.95,18.44 v13.89,17.38
  Bottom 0.61: 44.93,17.46 42.31,17.46 35.96,23.81 35.56,23.81 | 35.56,23.81 35.56,28.26 v33.02,30.8 | v33.81,13.65 33.81,22.07 35.56,23.81
  Bottom 0.813: v48.02,35.48 47.07,35.48 45.27,33.68 C2.1 45.27,32.49 43.5,30.72 38.81,30.72 v36.35,33.26
BOOT0
  Top 0.254: R4.1 21.75,36.27
  Top 0.305: U4.P$94 21.29,33.67 22.23,34.61 22.23,35.8 21.75,36.27
BUCK_FB1
  Top 0.254: U1.P$4 43.61,35.44 | 44.83,35.96 R1.1 | R2.2 R1.1 | R1.1 C14.1
  Top 0.305: 43.61,35.44 44.13,35.96 44.83,35.96
BUCK_SW1
  Top 0.305: U1.P$6 41.92,37.29 40.88,38.34 40.88,39.4 L1.P$1
COMP1_C1
  Top 0.254: C19.2 10.41,41.62 U7.P$6
COMP1_DRDY  (via drill 0.5)
  Top 0.254: U4.P$88 24.29,41.2 v24.77,41.67 | v6.67,40.56 6.67,39.77 7.21,39.22 U7.P$9
  Bottom 0.254: v24.77,41.67 22.3,41.67 21.67,42.31 8.41,42.31 v6.67,40.56
COMP1_INT1  (via drill 0.5)
  Top 0.305: U7.P$4 13.97,38.42 v16.83,41.27 | v25.16,33.5 25.29,33.37 U4.P$86
  Bottom 0.305: v16.83,41.27 21.59,41.27 23.02,39.85 23.02,39.45 22.3,38.73 22.3,36.35 v25.16,33.5
COMP1_INT2  (via drill 0.5)
  Top 0.254: U4.P$87 24.79,30.27 23.02,28.5 21.43,28.5 v20.88,29.05 | v12.86,39.21 v12.85,39.22 U7.P$5
  Bottom 0.254: v20.88,29.05 20.88,30.08 19.84,31.11 18.18,31.11 18.02,30.96 17.62,30.96 14.13,34.45 14.13,37.94 v12.86,39.21
COMP2_C1
  Top 0.254: C21.2 21.66,7.94 U8.P$6
COMP2_DRDY  (via drill 0.5)
  Top 0.254: U8.P$9 18.33,6.99 17.7,7.62 17.7,8.57 18.73,9.6 21.11,9.6 23.42,11.91 v23.42,12.46 | v25.24,12.86 24.79,13.31 U4.P$39
  Bottom 0.254: v23.42,12.46 23.81,12.86 v25.24,12.86
COMP2_INT1
  Top 0.254: U8.P$4 27.07,6.19 27.7,6.83 27.7,9.29 26.79,10.2 U4.P$43
COMP2_INT2  (via drill 0.5)
  Top 0.254: U8.P$5 21.67,7.14 v22.7,7.14 | v22.7,8.73 22.7,10.24 24.29,11.83 U4.P$38
  Bottom 0.254: v22.7,7.14 v22.7,8.73
DCMI_D0_MCK  (via drill 0.5)
  Top 0.305: v20.56,23.65 U4.P$63 30.4,23.65 30,23.26 30,18.18 31.35,16.83 32.54,16.83 37.39,11.99 37.39,10.72 v39.53,8.57 | v47.78,10.56 47.78,6.03 47.07,5.32 42.15,5.32 v41.91,5.08
  Bottom 0.254: v20.56,23.65 20.24,23.97 20.24,24.92 18.73,26.43 18.73,27.07 17.07,28.73 16.27,28.73 12.54,32.46 J4.1
  Bottom 0.305: v39.53,8.57 39.53,6.75 41.2,5.08 v41.91,5.08 | J5.6 46.56,12.62 46.83,12.62 47.39,12.06 47.39,10.95 v47.78,10.56
DCMI_D1  (via drill 0.5)
  Top 0.305: v20.95,24.69 21.49,24.15 U4.P$64
  Bottom 0.254: v20.95,24.69 20.95,25.72 17.3,29.37 16.35,29.37 12.3,33.42 10.79,33.42 10.4,33.02 J4.3
DCMI_D2  (via drill 0.5)
  Top 0.254: U4.P$97 19.79,28.44 v17.94,26.59
  Bottom 0.254: J4.5 9.13,31.67 9.29,31.51 12.7,31.51 15.95,28.26 16.27,28.26 v17.94,26.59
DCMI_D3  (via drill 0.5)
  Top 0.254: v18.81,30.24 19.29,30.72 U4.P$98
  Top 0.305: U4.P$98
  Bottom 0.254: v18.81,30.24 18.57,30 16.59,30 12.62,33.97 8.18,33.97 7.86,33.66 J4.7
DCMI_D4  (via drill 0.5)
  Top 0.254: U4.P$3 14.45,28.65 v13.1,30
  Bottom 0.254: v13.1,30 12.22,30.88 7.7,30.88 6.59,31.99 J4.9
DCMI_D5  (via drill 0.5)
  Top 0.254: v17.54,32.07 17.54,33.26 17.07,33.73 6.11,33.73 5.32,32.94 J4.11
  Top 0.305: U4.P$92 22.29,30.54 v21.67,29.92
  Bottom 0.254: v21.67,29.92 20.08,32.07 v17.54,32.07
DCMI_D6
  Top 0.254: U4.P$4 13.71,28.15 11.94,29.92 J4.2
DCMI_D7
  Top 0.254: U4.P$5 11.95,27.65
  Top 0.406: 11.95,27.65 10.4,29.21 J4.4
DCMI_HSYNC  (via drill 0.5)
  Top 0.305: v19.53,17.7 19.79,17.44 U4.P$29
  Bottom 0.254: 19.53,24.53 18.81,25.24 18.26,25.24 16.91,26.59 9.21,26.59 6.59,29.21 J4.10
  Bottom 0.305: v19.53,17.7 20.16,17.07 21.11,17.07 21.43,17.38 21.43,22.7 21.35,22.78 20.24,22.78 19.68,23.34 19.68,24.37 19.53,24.53
DCMI_PIXCLK  (via drill 0.5)
  Top 0.305: v20.56,17.94 20.79,17.71 U4.P$31
  Top 0.406: v12.3,25.72 9.13,28.89 J4.6
  Bottom 0.254: 18.97,24.21 18.57,24.61 18.02,24.61 18.02,24.69 16.75,25.96 12.54,25.96 v12.3,25.72
  Bottom 0.305: v20.56,17.94 20.56,18.26 20.88,18.57 20.88,22.15 20.72,22.3 20,22.3 19.13,23.18 19.13,24.05 18.97,24.21
DCMI_VSYNC  (via drill 0.5)
  Top 0.305: v22.15,33.1 21.79,32.74 U4.P$93 | J4.8 7.86,30.56 8.1,30.8 14.92,30.8 16.59,32.46 16.59,32.94 v16.67,33.02
  Bottom 0.305: v16.67,33.02 17.86,33.02 18.02,32.86 21.91,32.86 v22.15,33.1
GND  (via drill 0.5)
  Top 0.254: U1.P$1 43.26,33.85 43.26,33.34 43.42,33.5 | 43.89,33.26 43.89,33.1 | SB1.P$3 19.58,36.11 C3.2 | U4.P$10 14.93,25.15 v14.84,25.16 | J1.P$5 43.29,29.08 v43.26,29.05 | C12.2 35.72,29.82 35.72,29.13 35.24,28.65 33.34,28.65 32.84,29.15 U4.P$74 29.79,29.15 28.97,28.34 | U1.P$9 40.92,35.44 U1.P$17 40.92,33.94 U1.P$13 | U4.P$27 18.79,16.61 18.34,17.07 | U4.P$20 17.53,20.15 17.86,20.48 17.86,21.99 v18.02,22.15
  Top 0.305: 29.37,36.27 30.96,34.69 30.96,33.42 30.72,33.18 | 18.34,17.07 18.34,17.3 v17.94,17.7 | U4.P$27 18.79,15.14 18.41,14.76 17.78,14.76 v17.07,13.89 | LED2.C 41.89,17.44 | LED3.C 45.78,17.44 v46.75,18.41 | LED1.C 38.24,17.44 v38.58,17.54
  Bottom 0.305: J2.P$3 28.76,39.31
  other vias: 41.67,34.69 2.62,32.31 19.21,38.89 12.7,35.8 16.43,37.54 16.59,44.45 43.66,33.18 43.42,32.23 40.32,29.53 36.59,28.97 26.91,25.72 23.81,25.08 29.05,40.32 30.4,32.78 22.94,34.05 3.1,20.4 7.78,24.13 7.78,23.26 21.03,27.46 23.89,27.46 5.4,38.66 2.78,36.04 4.6,23.97 6.03,31.19 1.91,42.39 7.7,48.26 40.48,24.92 25.88,7.94 17.54,6.43 3.25,18.34 5.16,18.34 28.65,8.41 31.91,13.26 27.7,18.34 29.92,12.06 32.78,3.81 28.57,3.17 25.16,11.83 26.91,7.94 23.81,1.67 20.32,5.16 7.94,3.97 33.58,23.65 30.72,20.95 39.13,6.03 48.82,22.94 42.78,18.49 47.86,15 37.15,1.67 45.48,1.11 26.67,21.59 35.24,11.59 45.24,12.94 36.43,20.48 43.81,16.51 24.21,21.67 24.13,20.16 26.67,20.24 18.49,20.08 19.13,21.19 13.26,25.08 4.6,27.07 2.46,27.15 29.69,39.61 33.66,43.58 47.7,39.05 34.61,39.85 37.62,37.54 33.58,36.75 44.05,47.39 47.55,42.23 38.66,35.8 37.7,39.53 25.4,47.15 37.23,42.7 15.4,1.35 28.18,4.37 30.64,6.99 33.73,42.15 26.51,43.97 7.38,43.97 1.43,39.05 12.54,45.4 13.34,43.89 15.16,47.55 1.83,11.27 1.83,8.97 9.05,7.86 45.24,3.81
  pour Top (isolate 0.305): 0,49.78 49.78,49.78 49.78,0 0,0
  pour Bottom (isolate 0.305): 0,49.78 49.78,49.78 49.78,0 0,0
GYR1_DRDY  (via drill 0.5)
  Top 0.254: U4.P$17 13.4,21.65 v11.59,19.84 | v11.83,10.16 11.91,10.08 11.91,9.13 12.07,8.96 U2.P$6
  Bottom 0.254: v11.59,19.84 11.59,19.37 11.83,19.13 v11.83,10.16
GYR1_INT1  (via drill 0.5)
  Top 0.254: U4.P$18 14.25,21.15 v13.1,20.08 | v11.11,9.37 11.42,9.06 U2.P$7
  Bottom 0.254: v11.11,9.37 11.51,8.97 11.51,8.02 13.1,8.02 13.1,8.89 13.41,9.21 13.41,10.4 12.78,11.03 12.78,19.76 v13.1,20.08
GYR2_DRDY
  Top 0.254: U9.P$6 31.19,9.76 31.04,9.92 28.57,9.92 27.79,10.71 U4.P$45
GYR2_INT1
  Top 0.254: U9.P$7 30.56,9.21 30.4,9.37 28.34,9.37 27.29,10.41 U4.P$44
GYR_RES1
  Top 0.305: C1.2 11.42,3.1 U2.P$14
GYR_RES2
  Top 0.305: U9.P$14 30.55,3.01 C23.2
I2C1_SCL  (via drill 0.5)
  Top 0.254: U10.1 20.97,43.01 21.83,42.15 v21.83,39.85
  Top 0.305: U7.P$2 14.36,36.82 17.14,39.61 17.54,39.61 v17.78,39.85 | U4.P$95 20.79,34.36 v21.43,35
  Bottom 0.254: 21.67,40.01 v21.83,39.85 20.95,40.72 18.65,40.72 v17.78,39.85 17.78,38.26 19.86,36.18 R6.1 20.32,35.08 20.4,35 v21.43,35
I2C1_SDA  (via drill 0.5)
  Top 0.254: U10.6 18.93,42.72 18.93,42.19 20.72,40.4 20.72,35.16 19.92,34.37 v19.92,33.89 20,33.81 20,32.78 20.29,32.5 U4.P$96
  Top 0.305: U7.P$3 14.36,37.62 18.93,42.19
  Bottom 0.254: R5.1 v19.92,33.89
I2C2_SCL  (via drill 0.5)
  Top 0.254: 24.84,4.59 23.81,4.59 U8.P$2
  Top 0.305: U4.P$47 28.79,16.77 28.57,16.99 27.62,16.99 26.67,17.94 v26.67,18.02
  Top 0.406: 24.84,4.59 R9.1 25.62,2.87 v25.96,2.54 | v22.54,1.98 23.81,3.25 23.81,4.59
  Bottom 0.254: 4.37,5.56 4.37,7.14 4.13,7.38 3.54,7.38 J7.13
  Bottom 0.305: v26.67,18.02 26.67,14.05 29.37,11.35 32.7,11.35 35.32,8.73 35.32,3.41 33.73,1.83 26.67,1.83 v25.96,2.54 | v22.54,1.98 21.83,1.98 21.67,2.14 7.78,2.14 4.37,5.56
I2C2_SDA  (via drill 0.5)
  Top 0.254: 21.6,5.32 U8.P$3
  Top 0.305: U4.P$48 29.29,17.15 v28.65,17.78 | 21.6,5.32 21.68,5.4 v23.73,5.4 25.54,5.4 R8.1
  Bottom 0.254: 9.53,2.78 7.94,2.78 4.92,5.79 4.92,7.7 4.29,8.33
  Bottom 0.305: J7.11 3.62,8.57 4.05,8.57 4.29,8.33 | 9.53,2.78 22.23,2.78 23.69,4.25 | 23.69,4.25 23.73,4.29 v23.73,5.4 | v28.65,17.78 28.65,17.7 30.8,15.56 30.8,12.94 31.75,11.99 32.94,11.99 35.88,9.05 35.88,3.02 34.05,1.19 25.72,1.19 24.45,2.46 24.45,3.49 23.69,4.25
LED1
  Top 0.254: U4.P$59 36.66,21.65 37.24,22.24 R11.2
LED2
  Top 0.254: U4.P$60 36.36,22.15 37.23,23.02 40.66,23.02 R12.2
LED3
  Top 0.254: U4.P$61 36.07,22.65 36.99,23.57 42.15,23.57 43.34,22.38 44.7,22.38 R13.2
MIC_LR  (via drill 0.5)
  Top 0.305: U3.2 41.2,0.95 v41.43,0.71
  Bottom 0.305: v41.43,0.71 41.43,2.38 SB3.P$2
N$6
  Top 0.406: C22.2 18.16,4.78 18.34,4.59 U8.P$12
N$7
  Top 0.254: U7.P$12 7.9,36.92 C20.2
N$9
  Top 0.406: R11.1 LED1.A
N$16
  Top 0.406: R12.1 LED2.A
N$17
  Top 0.406: R13.1 LED3.A
N$23
  Top 0.406: C22.1 18.8,3.48 U8.P$13
N$27
  Top 0.254: U7.P$13 7.61,35.62 C20.1
N$62
  Top 0.305: U4.P$19 14.94,20.65 14.92,20.64
  Top 0.406: SB2.P$2 12.78,18.49 14.92,20.64
NRESET  (via drill 0.5)
  Top 0.254: 15.69,23.15 12.28,23.15 11.51,22.38 11.51,21.03 10.87,20.4
  Top 0.305: U4.P$14 15.69,23.15
  Top 0.406: 10.87,20.4 5.79,20.4 1.03,25.08 1.03,36.2 13.97,49.13 22.07,49.13 v22.3,48.9 | v34.53,48.1 33.85,48.1 J3.10
  Bottom 0.406: v22.3,48.9 34.53,48.9 v34.53,48.1
OSC_IN
  Top 0.305: U4.P$12 10.88,24.15 X1.P$2 9.22,25.81
  Top 0.406: 9.22,25.81 C4.2
OSC_OUT
  Top 0.254: 14.79,23.65 11.53,23.65 X1.P$1
  Top 0.305: 14.79,23.65 U4.P$13 | 9.22,21.34 X1.P$1
  Top 0.406: C5.2 9.22,21.34
PA0
  Top 0.305: U4.P$23 15,18.65 14.76,18.41 14.76,16.91 14.45,16.59 8.26,16.59 7.38,15.72 6.35,15.72 5.87,15.24 J7.2
PA1
  Top 0.305: U4.P$24 15.61,18.15 15.4,17.94 15.4,16.59 14.76,15.95 8.49,15.95 6.51,13.97 J7.4
PA7
  Top 0.254: U4.P$32 21.29,14.46 19.92,13.1 9.6,13.1 9.21,12.7 J7.6
PB0
  Top 0.254: U4.P$35 22.79,13.82 20.56,11.59 10.08,11.59 7.38,8.89 J7.12
PB1
  Top 0.254: U4.P$36 23.29,13.53 20.8,11.03 10.24,11.03 6.83,7.62 J7.14
PC4
  Top 0.254: U4.P$33 21.79,14.25 20.16,12.62 9.84,12.62 8.65,11.43 J7.8
PC5
  Top 0.254: U4.P$34 22.29,14.03 20.32,12.06 9.92,12.06 8.02,10.16 J7.10
PDR_ON
  Top 0.305: U4.P$99 18.79,34.63 SB1.P$2
PE9  (via drill 0.5)
  Top 0.254: U4.P$40 25.29,14.08 26.04,13.34 26.04,10.87 v25.24,10.08 | v17.22,9.29 16.67,8.73 16.67,5.56 v15.32,4.21 | J7.9 3.97,10.16 4.52,9.6 4.52,5.95 5.16,5.32 v7.78,5.32
  Bottom 0.254: 19.37,10 17.94,10 v17.22,9.29 | v15.32,4.21 8.89,4.21 v7.78,5.32
  Bottom 0.305: v25.24,10.08 19.45,10.08 19.37,10
PE11  (via drill 0.5)
  Top 0.305: v13.73,14.37 10.16,14.37 9.84,14.05 8.97,14.05 v8.41,14.61 | v20,19.61 21.27,19.61 22.62,18.26 25.24,18.26 26.29,17.21 U4.P$42
  Bottom 0.254: v8.41,14.61 8.41,15.32 7.38,16.35 5.24,16.35 4.6,15.72 4.6,11.91 4.21,11.51 3.38,11.51 J7.7
  Bottom 0.305: v13.73,14.37 13.81,14.29 14.53,14.29 16.91,16.67 19.13,16.67 18.81,16.99 18.81,18.1 19.13,18.41 19.84,18.41 20.24,18.81 20.24,19.37 v20,19.61
POW_CHRG  (via drill 0.5)
  Top 0.254: U4.P$81 27.79,39.36 26.59,40.56 26.59,41.27 27.07,41.75 v28.89,41.75 | U1.P$15 41.92,32.56 41.67,32.31 41.67,29.77 40.4,28.5 v39.93,28.5
  Bottom 0.254: v28.89,41.75 30.8,39.85 33.1,39.85 35,37.94 35,33.42 v39.93,28.5
POW_HPWR
  Top 0.254: U4.P$82 27.29,30.66 27.7,30.24 30.56,30.24 34.92,34.61 37.15,34.61 37.82,33.94 U1.P$12
POW_PROG
  Top 0.254: U1.P$14 41.42,32.69 40.96,32.23 40.55,32.23 R3.1
POW_SUSP  (via drill 0.5)
  Top 0.254: U4.P$85 25.79,30.49 26.51,29.77 30.8,29.77 35.08,34.05 36.91,34.05 37.86,33.1 v38.02,33.1 | U1.P$11 38.03,34.44 37.39,35.08 36.2,35.08 v35.88,35.4
  Bottom 0.254: v38.02,33.1 38.02,33.26 v35.88,35.4
SD_CLK  (via drill 0.5)
  Top 0.305: U4.P$80 28.29,40.21 v27.86,40.64
  Bottom 0.305: v27.86,40.64 27.66,40.44 J2.P$4
SD_CMD  (via drill 0.5)
  Top 0.305: U4.P$83 26.79,39.33 v26.43,39.69
  Bottom 0.305: v26.43,39.69 25.46,38.71 J2.P$6
SD_DAT0_I2C3_SCL  (via drill 0.5)
  Top 0.254: v36.99,24.37 36.72,24.65 U4.P$65
  Top 0.305: J5.10 45.88,10.16 45.56,9.84 45.56,6.59 44.93,5.95 41.75,5.95 v41.59,6.11 | v39.85,16.11 39.85,21.83 v39.69,21.99
  Bottom 0.254: J2.P$2 29.86,36.9 37.62,29.13 37.62,25 v36.99,24.37 | v39.85,16.11 40.24,16.11 41.27,15.08 41.27,14.84 40.96,14.53 40.96,13.49
  Bottom 0.305: v39.69,21.99 38.89,21.99 37.07,23.81 37.07,24.29 v36.99,24.37 | J5.10 46.99,10.16 48.1,9.05 48.58,9.05 48.58,11.43 48.26,11.75 R14.1 48.26,11.83 | 40.96,13.49 41.2,13.26 41.2,6.51 v41.59,6.11
SD_DAT1_I2C3_SDA  (via drill 0.5)
  Top 0.254: v38.34,25.16 32.05,25.16 U4.P$66 | J5.8 47.4,11.43 R15.1
  Top 0.305: v40.56,20.88 40.56,17.14 40.64,17.07 40.64,15.4 v40.08,14.84 | v40.32,7.78 41.12,7.78 42.31,6.59 44.29,6.59 45.01,7.3 45.01,10.48 45.88,11.35 46.4,11.35 J5.8
  Bottom 0.254: J2.P$1 30.96,36.67 38.34,29.29 v38.34,25.16
  Bottom 0.305: v38.34,25.16 38.34,23.73 39.13,22.94 40.08,22.94 40.72,22.3 40.72,21.03 v40.56,20.88 | v40.08,14.84 40.08,13.41 40.56,12.94 40.56,8.02 v40.32,7.78
SD_DAT2  (via drill 0.5)
  Top 0.305: U4.P$78 29.29,33.26 v29.61,33.58
  Bottom 0.305: J2.P$8 23.26,36.75 26.04,33.97 29.21,33.97 v29.61,33.58
SD_DAT3  (via drill 0.5)
  Top 0.305: U4.P$79 28.79,34.74 29.55,34.74 v29.69,34.61
  Bottom 0.305: J2.P$7 24.36,36.68 26.04,35 29.29,35 v29.69,34.61
SD_DET  (via drill 0.5)
  Top 0.254: U4.P$84 26.29,37.85 25.48,38.66 25.48,45.48 26.35,46.35 v26.51,46.35
  Bottom 0.254: v26.51,46.35 31.3,46.35 J2.P$10
SPI1_MISO  (via drill 0.5)
  Top 0.254: U9.P$4 33.44,7.25 v34.13,7.94 | U2.P$4 13.7,7.98 v13.97,8.26 15.08,9.37 v15.32,9.37
  Top 0.305: U4.P$90 23.29,30.04 v22.54,29.29
  Bottom 0.254: v22.54,29.29 22.54,29.05 21.99,28.5 21.99,17.07 21.03,16.11 17.14,16.11 13.34,12.3 13.34,11.27 13.97,10.64 v13.97,8.26 | v34.13,7.94 34.13,8.18 32.86,9.45 26.11,9.45 25.8,9.13 24.77,9.13 24.45,9.45 22.15,9.45 21.19,8.49 15.72,8.49 15.32,8.89 v15.32,9.37
SPI1_MOSI  (via drill 0.5)
  Top 0.254: v15.08,6.51 14.93,6.36 U2.P$3
  Top 0.305: U4.P$91 22.79,32.39 v23.1,32.7 | v32.54,10.4 34.13,8.81 34.45,8.81 34.92,8.33 34.92,7.54 33.98,6.6 U9.P$3
  Bottom 0.254: v23.1,32.7 23.1,29.77 23.5,29.37 23.5,28.81 22.62,27.94 22.62,16.91 21.19,15.48 | 21.19,15.48 17.3,15.48 16.83,15 16.75,15 13.89,12.14 13.89,11.51 14.53,10.87 14.53,8.89 14.84,8.57 14.84,6.75 v15.08,6.51 | 22.3,10.72 21.11,11.91 21.11,15.4 21.19,15.48
  Bottom 0.305: 22.3,10.72 24.69,10.72 24.92,10.95 25.56,10.95 26.11,10.4 26.11,10 32.15,10 v32.54,10.4
SPI1_SCK  (via drill 0.5)
  Top 0.254: v16.67,10.24 16.11,9.68 16.11,6.35 15.24,5.48
  Top 0.305: U4.P$30 20.29,14.73 v19.61,14.05 | 15.24,5.48 14.84,5.48 | 14.84,5.48 14.61,5.71 U2.P$2 | U9.P$2 34.36,5.95 v34.45,6.03 | 14.84,5.48 14.84,5.08 14.45,4.68 14.45,3.73 14.76,3.41 16.03,3.41 v16.19,3.57
  Bottom 0.305: v19.61,14.05 19.61,11.27 18.89,10.56 16.99,10.56 v16.67,10.24 | v34.45,6.03 24.77,6.03 24.45,6.35 19.13,6.35 | v16.19,3.57 16.35,3.57
  Bottom 0.406: 16.35,3.57 19.13,6.35
SPI2_MISO_EXT_SD
  Top 0.254: U4.P$53 33.1,18.65 41.59,10.16 J5.9
SPI2_MOSI_SD
  Top 0.254: U4.P$54 33.31,19.15 41.04,11.43 J5.7
SPI2_NSS_WS
  Top 0.305: U4.P$51 32.51,17.65 42.55,7.62 J5.13 43.97,7.62
SPI2_SCK_CK
  Top 0.305: U4.P$52 32.8,18.15 42.07,8.89 J5.11
SPI_CS_GYR1  (via drill 0.5)
  Top 0.254: U4.P$16 12.47,22.15 v12.3,21.99 | v12.62,9.53 12.72,9.42 U2.P$5
  Bottom 0.254: v12.3,21.99 12.3,10.79 12.62,10.48 v12.62,9.53
SPI_CS_GYR2
  Top 0.254: U9.P$5 31.83,8.24 31.83,10.08 31.43,10.48 28.89,10.48 28.29,11.08 U4.P$46
SWDCLK
  Top 0.254: U4.P$76 31.43,32.55 31.43,40.4
  Top 0.305: 31.43,40.4 29.37,42.47 27.94,42.47 27.54,42.86 27.54,45.4 28.18,46.04 29.13,46.04 29.84,46.75 J3.4
SWDIO  (via drill 0.5)
  Top 0.254: U4.P$72 37.92,28.15 38.89,29.13 v38.89,32.38
  Top 0.406: v37.39,35.88 36.67,35.88 35.96,36.59 35.96,48.34 35,49.29 28.81,49.29 28.57,49.05 J3.2 | 28.65,47.83 J3.2 | J3.2 28.57,47.86
  Bottom 0.254: v38.89,32.38 38.89,33.42 37.39,34.92 v37.39,35.88
SWO  (via drill 0.5)
  Top 0.254: U4.P$89 23.79,42.28 v24.37,42.86
  Top 0.406: J3.6 31.11,46.2 31.43,45.88 34.92,45.88 35,45.8 v35,45.16
  Bottom 0.254: v24.37,42.86 30.08,42.86 30.8,42.15
  Bottom 0.406: v35,45.16 35,41.35 34.53,40.88 32.07,40.88 30.8,42.15
TEMP1_ADDR
  Top 0.254: R7.1 18.65,45.09 U10.4
TEMP1_EVT
  Top 0.254: R10.1 22.24,43.66 U10.2
USART1_CK  (via drill 0.5)
  Top 0.254: U4.P$67 37.56,25.65 37.94,26.04 40.56,26.04 43.66,22.94 45.64,22.94 46.51,22.07
  Top 0.305: 46.51,22.07 46.51,21.19 v46.91,20.8 | v48.82,19.76 48.82,11.27 49.13,10.95 49.13,5.71 48.1,4.68 43.74,4.68 U3.4
  Bottom 0.305: v46.91,20.8 47.78,20.8 v48.82,19.76
USART1_RX  (via drill 0.5)
  Top 0.305: U4.P$69 30.15,26.65 v28.57,25.08 | v32.31,15.4 32.62,15.08 33.5,15.08 36.67,11.91 36.67,9.6 v37.54,8.73 | v40.32,4.68 40.32,4.61 U3.5
  Bottom 0.305: v28.57,25.08 28.57,24.84 32.31,21.11 v32.31,15.4 | v37.54,8.73 37.54,5.48 38.26,4.76 40.24,4.76 v40.32,4.68
USART2_RX  (via drill 0.5)
  Top 0.305: U4.P$26 17.89,15.9 15.56,13.57 9.37,13.57 8.97,13.18 8.26,13.18 v7.86,13.57
  Bottom 0.254: J7.16 8.26,6.35 v8.33,6.43
  Bottom 0.305: v7.86,13.57 7.86,6.91 v8.33,6.43
USART2_TX  (via drill 0.5)
  Top 0.305: U4.P$25 16.54,16.94 14.84,15.24 10,15.24 v9.6,14.84
  Bottom 0.305: v9.6,14.84 9.6,16.59 6.99,19.21 2.54,19.21 0.87,17.54 0.87,7.62 1.98,6.51 3.14,6.51 J7.15
USART3_CK  (via drill 0.5)
  Top 0.305: U4.P$57 34.67,20.65 v36.04,19.21
  Bottom 0.254: 43.97,15.24 J5.1
  Bottom 0.305: v36.04,19.21 36.04,18.65 38.34,16.43 39.05,16.43 39.37,16.91 40.24,16.91 41.91,15.24 J5.1
USART3_RX
  Top 0.254: U4.P$56 33.74,20.15 40.72,13.18 42.86,13.18 43.66,13.97 J5.3
USART3_TX
  Top 0.254: U4.P$55 33.53,19.65 39.89,13.29 40.24,12.94 40.48,12.7 J5.5
USB_D+
  Top 0.254: U4.P$71 45.2,27.65 J1.P$3
USB_D-
  Top 0.254: U4.P$70 45.31,27.15 J1.P$2
VBAT  (via drill 0.5)
  Top 0.254: U1.P$7 41.42,36.84 41.04,37.23 | U1.P$2 U1.P$3 43.18,34.92 v44.21,34.92 | U1.P$5 43.02,36.79 v43.02,37.07
  Top 0.305: v41.75,14.13 41.75,15.56 43.58,17.38 43.58,21.03 v43.1,21.51 | v48.82,32.31 45.8,32.31 44.29,33.81 44.29,34.85 v44.21,34.92
  Top 0.406: 41.04,37.23 v40.4,37.23 39.61,37.23 39.29,37.54 39.29,43.81 37.94,45.16 J6.2
  Bottom 0.254: v41.75,14.13 41.75,7.78 42.39,7.14
  Bottom 0.305: v40.4,37.23 42.86,37.23 v43.02,37.07 44.21,35.88 v44.21,34.92 | J5.12 45.88,8.89 45.16,8.18 45.16,7.3 44.37,6.51 43.02,6.51 42.39,7.14 | v43.1,21.51 43.81,21.51 47.23,24.92 47.23,30.72 v48.82,32.31
  Bottom 0.406: C8.2 37.94,44.87 J6.2
VCAP_1
  Top 0.254: C10.1 29.79,13.18 U4.P$49
VCAP_2  (via drill 0.5)
  Top 0.254: U4.P$73 30.8,28.65 v30,27.86
  Bottom 0.254: C11.1 v30,27.86
VUSB  (via drill 0.5)
  Top 0.254: 43.71,26.48 v43.58,26.35 | U1.P$16 42.42,32.26 42.39,32.07
  Top 0.305: U4.P$68 32.9,26.15 33.42,26.67 43.26,26.67 v43.58,26.35 | 46.43,15.29 46.51,15.29 | 46.51,15.29 46.72,15.29 | J5.2 46.48,15.26 46.51,15.29
  Top 0.406: J1.P$1 43.71,26.48 | v43.58,26.35 43.58,24.84 43.42,24.69 43.42,24.13 44.05,23.5 46.12,23.5 47.78,21.83 47.78,16.35 46.72,15.29
  Top 0.61: 42.39,32.07 42.39,29.29 v41.83,28.73
  Bottom 0.254: v43.58,26.35 45.22,26.35 C7.2
  Bottom 0.61: v41.83,28.73 41.83,27.15 42.62,26.35 v43.58,26.35

### Text on the board
tDocu: Mag/Acc | y | z | x | Gyro: | z | x | y